# Altium schematic sheet USB-UART Driver.SchDoc: USB-UART Dongle
size A; Date: 3/13/2021; Author: Jesse Fernandez; CompanyName: GVSU; DrawnBy: Jesse Fernandez; Organization: Kennedy Hall of Engineering; Address1: 301 Fulton St. W; Address2: Grand Rapids, MI 49504; DocumentNumber: 1; Revision: 0.1; SheetNumber: 5; SheetTotal: 7; Time: 5:42 am
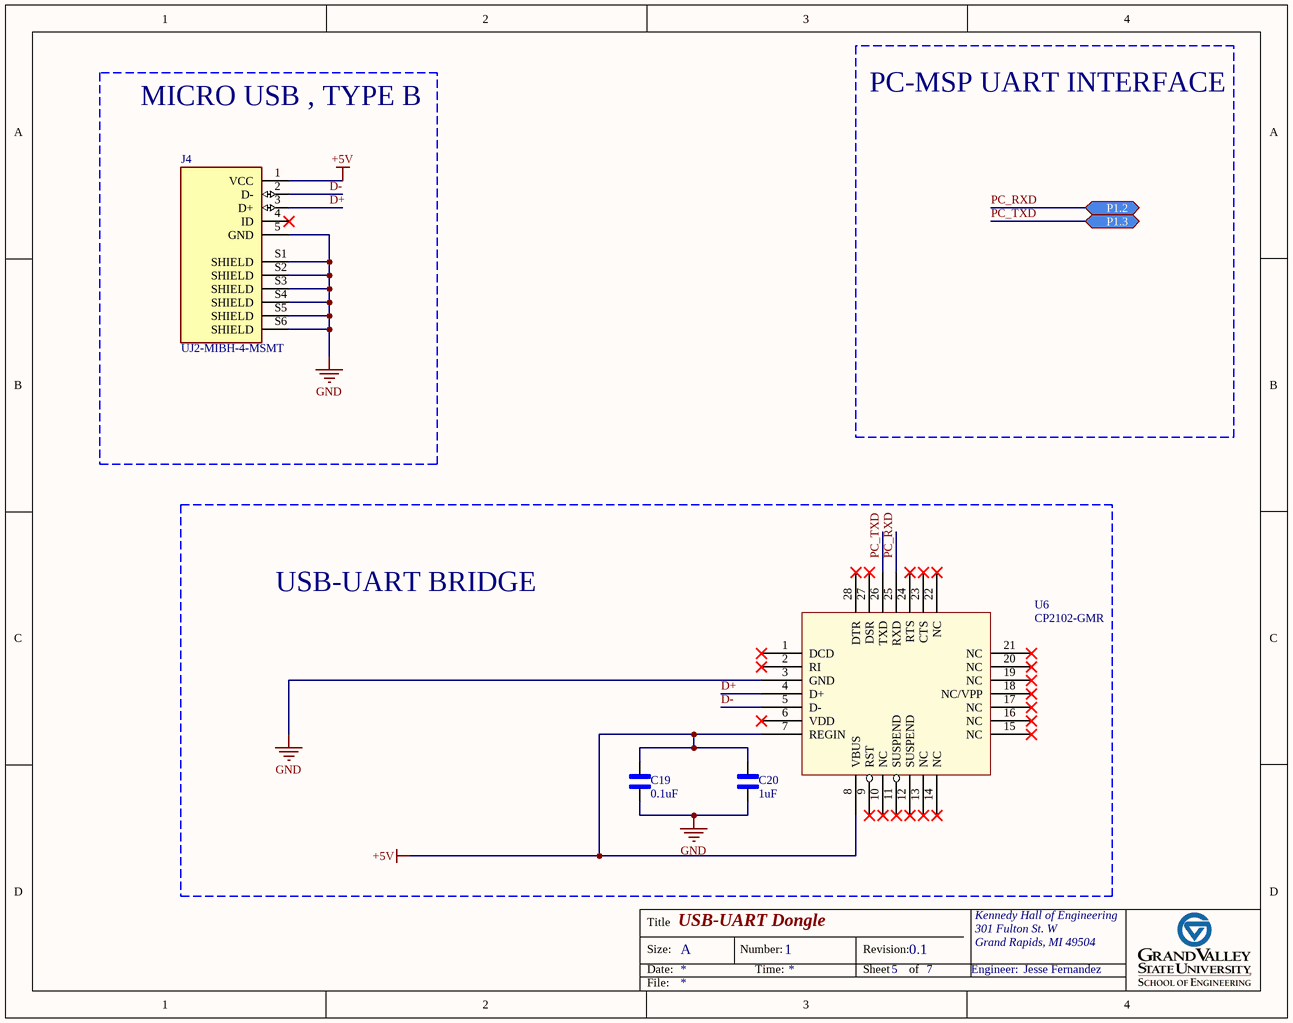
[diagram p0: USB-UART Driver.SchDoc]

## Parts
C19  value 0.1uF  [CAPC1005X55N]  (hidden comment: Multilayer Ceramic Cap. 0402 (1005 Metric))
C20  value 1uF  [CAPC1005X55N]  (hidden comment: Multilayer Ceramic Cap. 0402 (1005 Metric))
J4  UJ2-MIBH-4-MSMT  [UJ2-MIBH-4-MSMT]
U6  CP2102-GMR  [CP2102-GMR]

## Blocks framed on the sheet
MICRO USB , TYPE B: J4
USB-UART BRIDGE: C19 C20 U6

## Ports
P1.2 (bidir), P1.3 (bidir)

## Nets
+5V: C19.2 C20.2 J4.1(VCC) U6.7(REGIN) U6.8(VBUS)
GND: C19.1 C20.1 J4.5(GND) J4.S1(SHIELD) J4.S2(SHIELD) J4.S3(SHIELD) J4.S4(SHIELD) J4.S5(SHIELD) J4.S6(SHIELD) U6.3(GND)
D+: J4.3(D+) U6.4(D+)
D-: J4.2(D-) U6.5(D-)
PC_RXD: U6.25(RXD) ; port P1.2
PC_TXD: U6.26(TXD) ; port P1.3

Not connected (* = marked no-connect by the designer): J4 4(ID)*; U6 1(DCD)* 2(RI)* 6(VDD)* 9(RST)* 10(NC)* 11(SUSPEND)* 12(SUSPEND)* 13(NC)* 14(NC)* 15(NC)* 16(NC)* 17(NC)* 18(NC/VPP)* 19(NC)* 20(NC)* 21(NC)* 22(NC)* 23(CTS)* 24(RTS)* 27(DSR)* 28(DTR)*

## Notes on the sheet
- PC-MSP UART INTERFACE
- Title
- Size:
- Date:
- A
- Number:
- Time:
- Revision:
- Sheet
- of
- Engineer:
- File:

## Library data of the parts
C19 = Multilayer Ceramic Cap. 0402 (1005 Metric): Capacitor X6S 0402 (1005 Metric); Manufacturer: Murata Electronics; Manufacturer P/N: GRM155R71H104KE14D; Vendor: Mouser; Vendor P/N: 81-GRM155R71H104KE4D; Tolerance: 10%; Price: $0.10; ComponentLink1Description: Datasheet; ComponentLink1URL: *
C20 = Multilayer Ceramic Cap. 0402 (1005 Metric): Capacitor X6S 0402 (1005 Metric); Manufacturer: Murata Electronics; Manufacturer P/N: GRM155R70J105KA12J; Vendor: Mouser; Vendor P/N: 81-GRM155R70J105KA2J; Tolerance: 10%; Price: $0.11; ComponentLink1Description: Datasheet; ComponentLink1URL: *
J4 = UJ2-MIBH-4-MSMT: USB Connectors USB 2.0 micro B jack 5 pin HZ mid-mnt SMT; Manufacturer: CUI Devices; Manfacturer P/N: UJ2-MIBH-4-MSMT-TR; Vendor: Mouser; Vendor P/N: 490-UJ2-MIBH-4-MSMT; Price: $1.05; ComponentLink1Description: Datasheet; ComponentLink1URL: https://www.cuidevices.com/product/resource/uj2-mibh-4-msmt.pdf
U6 = CP2102-GMR: USB Bridge, USB to UART USB 2.0 UART Interface 28-QFN (5x5); Manufacturer: Silicon Labs; Vendor: LCSC Electronics; Vendor P/N: C6568; Manufacturer P/N: CP2102-GMR; Price: $2.36; ComponentLink1Description: Datasheet; ComponentLink1URL: https://www.silabs.com/documents/public/data-sheets/CP2102-9.pdf